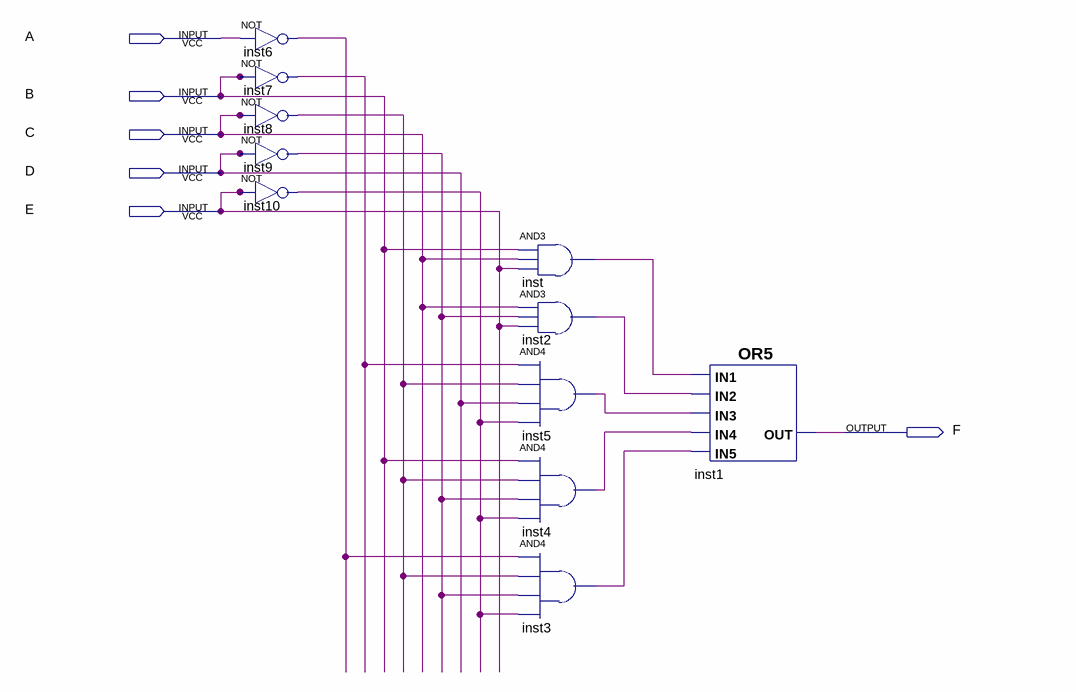
[diagram p0: schematic sheet]
// Quartus schematic Lab01.bdf as structural Verilog: 11 symbols, 6 pins
module Lab01 (
  input  A,
  input  B,
  input  C,
  input  D,
  input  E,
  output F
);

  wire inst2_out, inst3_out, inst4_out, inst5_out, inst6_out, inst7_out, inst8_out, inst9_out, inst10_out,
       inst_out;

  not inst6 (inst6_out, A);
  not inst7 (inst7_out, B);
  not inst8 (inst8_out, C);
  not inst9 (inst9_out, D);
  not inst10 (inst10_out, E);
  and inst (inst_out, B, C, E);
  and inst2 (inst2_out, C, inst9_out, E);
  and inst5 (inst5_out, inst7_out, inst8_out, D, inst10_out);
  and inst4 (inst4_out, B, inst8_out, inst9_out, inst10_out);
  and inst3 (inst3_out, inst6_out, inst8_out, inst9_out, inst10_out);
  or inst1 (F, inst_out, inst2_out, inst5_out, inst4_out, inst3_out);
endmodule
